# Altium schematic sheet AUDIO CODEC.SchDoc
size A4; SheetNumber: 2; SheetTotal: 9
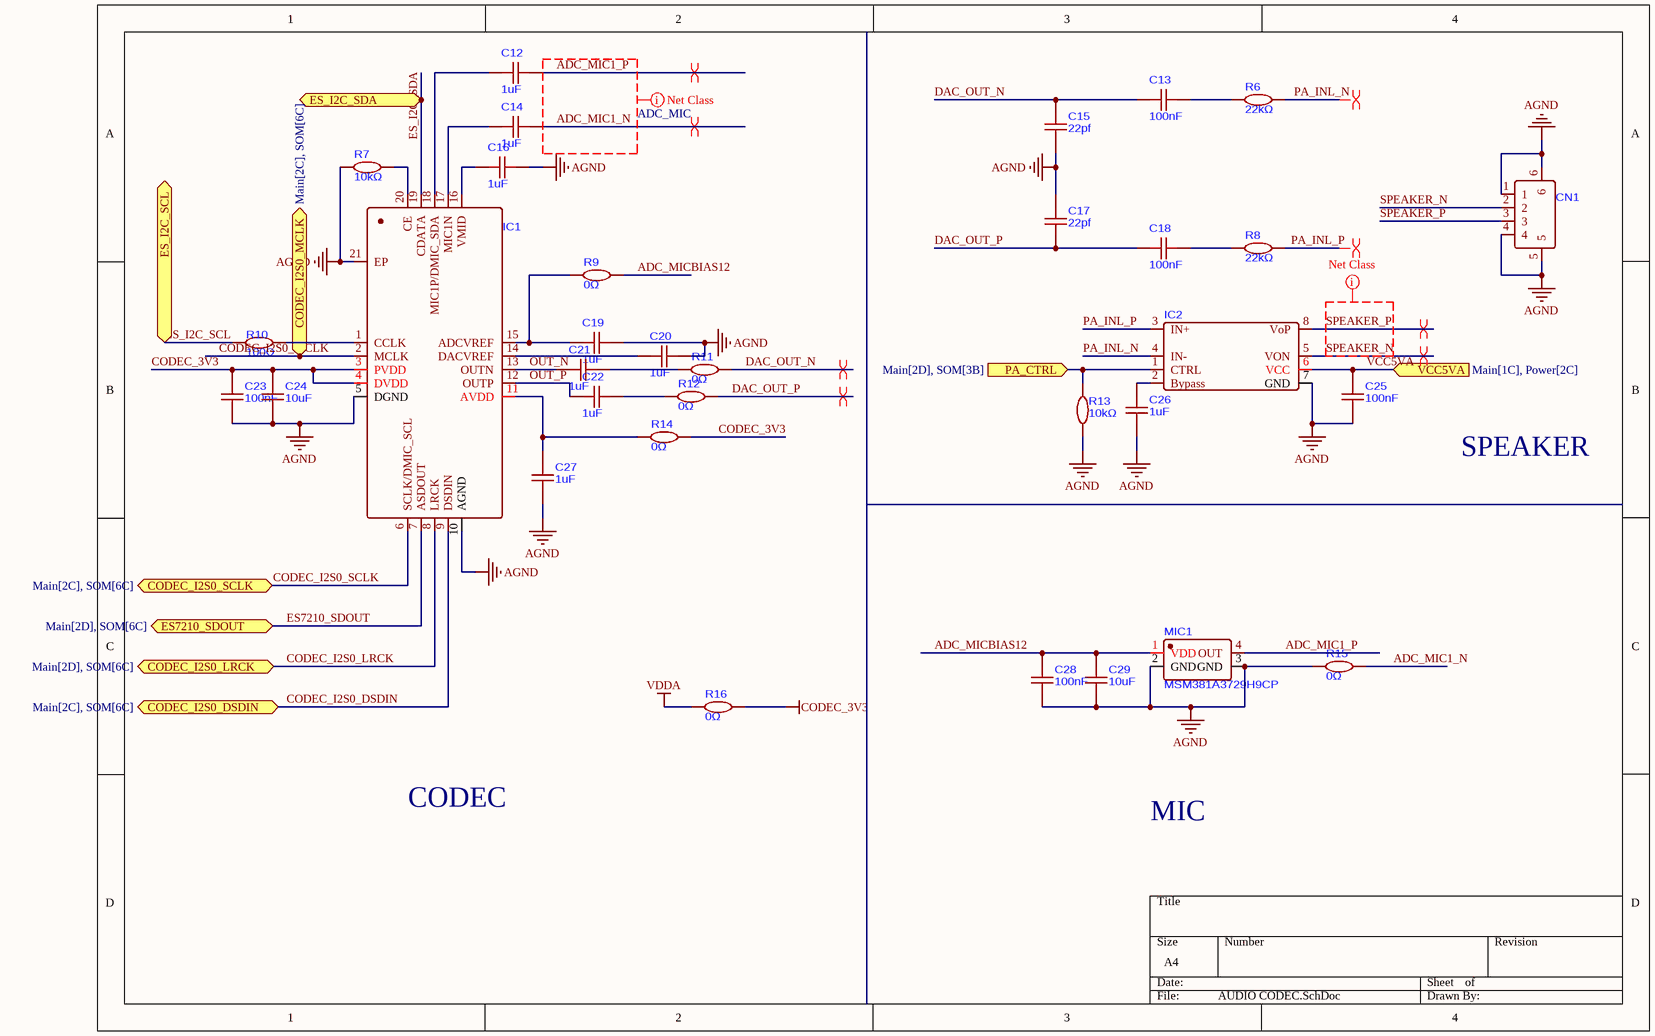
[diagram p0: AUDIO CODEC.SchDoc]

## Parts
C12  1uF  [C0603]
C13  100nF  [C0603]
C14  1uF  [C0603]
C15  22pf  [C0603]
C16  1uF  [C0603]
C17  22pf  [C0603]
C18  100nF  [C0603]
C19  1uF  [C0603]
C20  1uF  [C0603]
C21  1uF  [C0603]
C22  1uF  [C0603]
C23  100nF  [C0603]
C24  10uF  [C0603]
C25  100nF  [C0603]
C26  1uF  [C0603]
C27  1uF  [C0603]
C28  100nF  [C0603]
C29  10uF  [C0603]
CN1  533980471  [CONN-SMD_4P-P1.25_XUNPU_WAFER-GH1.25-4PWB]  (value not drawn)
IC1  Low Power Mono Audio CODEC  [WQFN-20_L3.0-W3.0-P0.40-BL-EP1.7]  (value not drawn)
IC2  NS4150B 3.0W Mono Class-D Audio Power Amplifier  [MSOP-8_L3.0-W3.0-P0.65-LS5.0-BL]  (value not drawn)
MIC1  MSM381A3729H9CP  [MIC-SMD_4P-L3.8-W3.0-P2.46-S1.70-TR]
R6  22kΩ  [R0603]
R7  10kΩ  [R0603]
R8  22kΩ  [R0603]
R9  0Ω  [R0603]
R10  100Ω  [R0603]
R11  0Ω  [R0603]
R12  0Ω  [R0603]
R13  10kΩ  [R0603]
R14  0Ω  [R0603]
R15  0Ω  [R0603]
R16  0Ω  [R0603]

## Ports
CODEC_I2S0_DSDIN (bidir, see Main[2C], SOM[6C]), CODEC_I2S0_LRCK (bidir, see Main[2D], SOM[6C]), CODEC_I2S0_MCLK (bidir, see Main[2C], SOM[6C]), CODEC_I2S0_SCLK (bidir, see Main[2C], SOM[6C]), ES7210_SDOUT (bidir, see Main[2D], SOM[6C]), ES_I2C_SCL (bidir, see Main[2C], DSI&CSI CONNECTOR[2C], interfaceUART&I2C[2C], SOM[6C]), ES_I2C_SDA (bidir, see Main[2C], DSI&CSI CONNECTOR[2C], interfaceUART&I2C[2C], SOM[6C]), PA_CTRL (in, see Main[2D], SOM[3B]), VCC5VA (in, see Main[1C], Power[2C])

## Nets
AGND: C15.1 C16.1 C17.2 C19.1 C20.1 C23.1 C24.1 C25.1 C26.1 C27.2 C28.1 C29.1 CN1.1 CN1.4 CN1.5 CN1.6 IC1.5(DGND) IC1.10(AGND) IC1.21(EP) IC2.7(GND) MIC1.2(GND) MIC1.3(GND) R7.1 R13.1 R15.1
CODEC_3V3: C23.2 C24.2 IC1.3(PVDD) IC1.4(DVDD) R14.2 R16.2
VDDA: R16.1
ADC_MIC1_N: C14.1 R15.2
ADC_MIC1_P: C12.2 MIC1.4(OUT)
ADC_MICBIAS12: C28.2 C29.2 MIC1.1(VDD) R9.2
CODEC_I2S0_DSDIN: IC1.9(DSDIN) ; port CODEC_I2S0_DSDIN
CODEC_I2S0_LRCK: IC1.8(LRCK) ; port CODEC_I2S0_LRCK
CODEC_I2S0_MCLK: IC1.2(MCLK) ; port CODEC_I2S0_MCLK
CODEC_I2S0_SCLK: IC1.6(SCLK/DMIC_SCL) ; port CODEC_I2S0_SCLK
DAC_OUT_N: C13.1 C15.2 R11.2
DAC_OUT_P: C17.1 C18.1 R12.2
ES7210_SDOUT: IC1.7(ASDOUT) ; port ES7210_SDOUT
ES_I2C_SCL: R10.1 ; port ES_I2C_SCL
ES_I2C_SDA: IC1.19(CDATA) ; port ES_I2C_SDA
OUT_N: C21.2 IC1.13(OUTN)
OUT_P: C22.2 IC1.12(OUTP)
PA_CTRL: IC2.1(CTRL) R13.2 ; port PA_CTRL
PA_INL_N: IC2.4(IN-) R6.2
PA_INL_P: IC2.3(IN+) R8.2
SPEAKER_N: CN1.2 IC2.5(VON)
SPEAKER_P: CN1.3 IC2.8(VoP)
VCC5VA: C25.2 IC2.6(VCC) ; port VCC5VA
NetC12_1: C12.1 IC1.18(MIC1P/DMIC_SDA)
NetC13_2: C13.2 R6.1
NetC14_2: C14.2 IC1.17(MIC1N)
NetC16_2: C16.2 IC1.16(VMID)
NetC18_2: C18.2 R8.1
NetC19_2: C19.2 IC1.15(ADCVREF) R9.1
NetC20_2: C20.2 IC1.14(DACVREF)
NetC21_1: C21.1 R11.1
NetC22_1: C22.1 R12.1
NetC26_2: C26.2 IC2.2(Bypass)
NetC27_1: C27.1 IC1.11(AVDD) R14.1
NetIC1_1: IC1.1(CCLK) R10.2
NetIC1_20: IC1.20(CE) R7.2

## Layout directives
net class ADC_MIC: ADC_MIC1_N, ADC_MIC1_P
differential pair; net class DIFF; differential pair class DIFF: ADC_MIC1_N, ADC_MIC1_P, DAC_OUT_N, DAC_OUT_P, PA_INL_N, PA_INL_P, SPEAKER_N, SPEAKER_P
net class SPEAKER: SPEAKER_N, SPEAKER_P

## Notes on the sheet
- SPEAKER
- CODEC
- MIC

## Library data of the parts
C12 C14 C16 C19-C22 C26 C27 = CL10B105KA8NNNC: 25V 1uF X7R ±10% 0603 Ceramic Capacitors ROHS
C13 C18 C23 C25 C28 = CC0603KRX7R9BB104: 50V 100nF X7R ±10% 0603 Ceramic Capacitors ROHS
C15 C17 = CL10C220JB8NNNC: 50V 22pF C0G ±5% 0603 Ceramic Capacitors RoHS
C24 C29 = CL10A106MA8NRNC: 25V 10uF X5R ±20% 0603 Ceramic Capacitors ROHS
CN1 = 533980471: 4P PicoBlade(MX 1.25) 1x4P Tin -40℃~+105℃ White 1.25mm 125V 4 1A 1 Surface Mount,Vertical SMD,P=1.25mm Headers, Male Pins RoHS
IC1 = ES8311: 1.8V~3.3V QFN-20-EP(3x3) Signal Switches, Multiplexers, Decoders RoHS
IC2 = NS4150: 4mA 1-Channel 3Wx1@4Ω Class D MSOP-8 Audio Amplifiers RoHS
MIC1 = MSM381A3729H9CP: OCLGA-4(3x3.8) MEMS Microphones ROHS
R6 R8 = RC0603FR-0722KL: 100mW 22kΩ 75V ±100ppm/℃ Thick Film Resistor ±1% 0603 Chip Resistor - Surface Mount RoHS
R7 R13 = RC0603FR-0710KL: 100mW 10kΩ 75V ±100ppm/℃ Thick Film Resistor ±1% 0603 Chip Resistor - Surface Mount ROHS
R9 R11 R12 R14-R16 = RC0603JR-070RL: 100mW 0Ω 75V Thick Film Resistor ±5% 0603 Chip Resistor - Surface Mount RoHS
R10 = RC0603FR-07100RL: 100mW 100Ω 75V ±100ppm/℃ Thick Film Resistor ±1% 0603 Chip Resistor - Surface Mount ROHS